# EAGLE design Focus_shield (EAGLE 9.6.2)
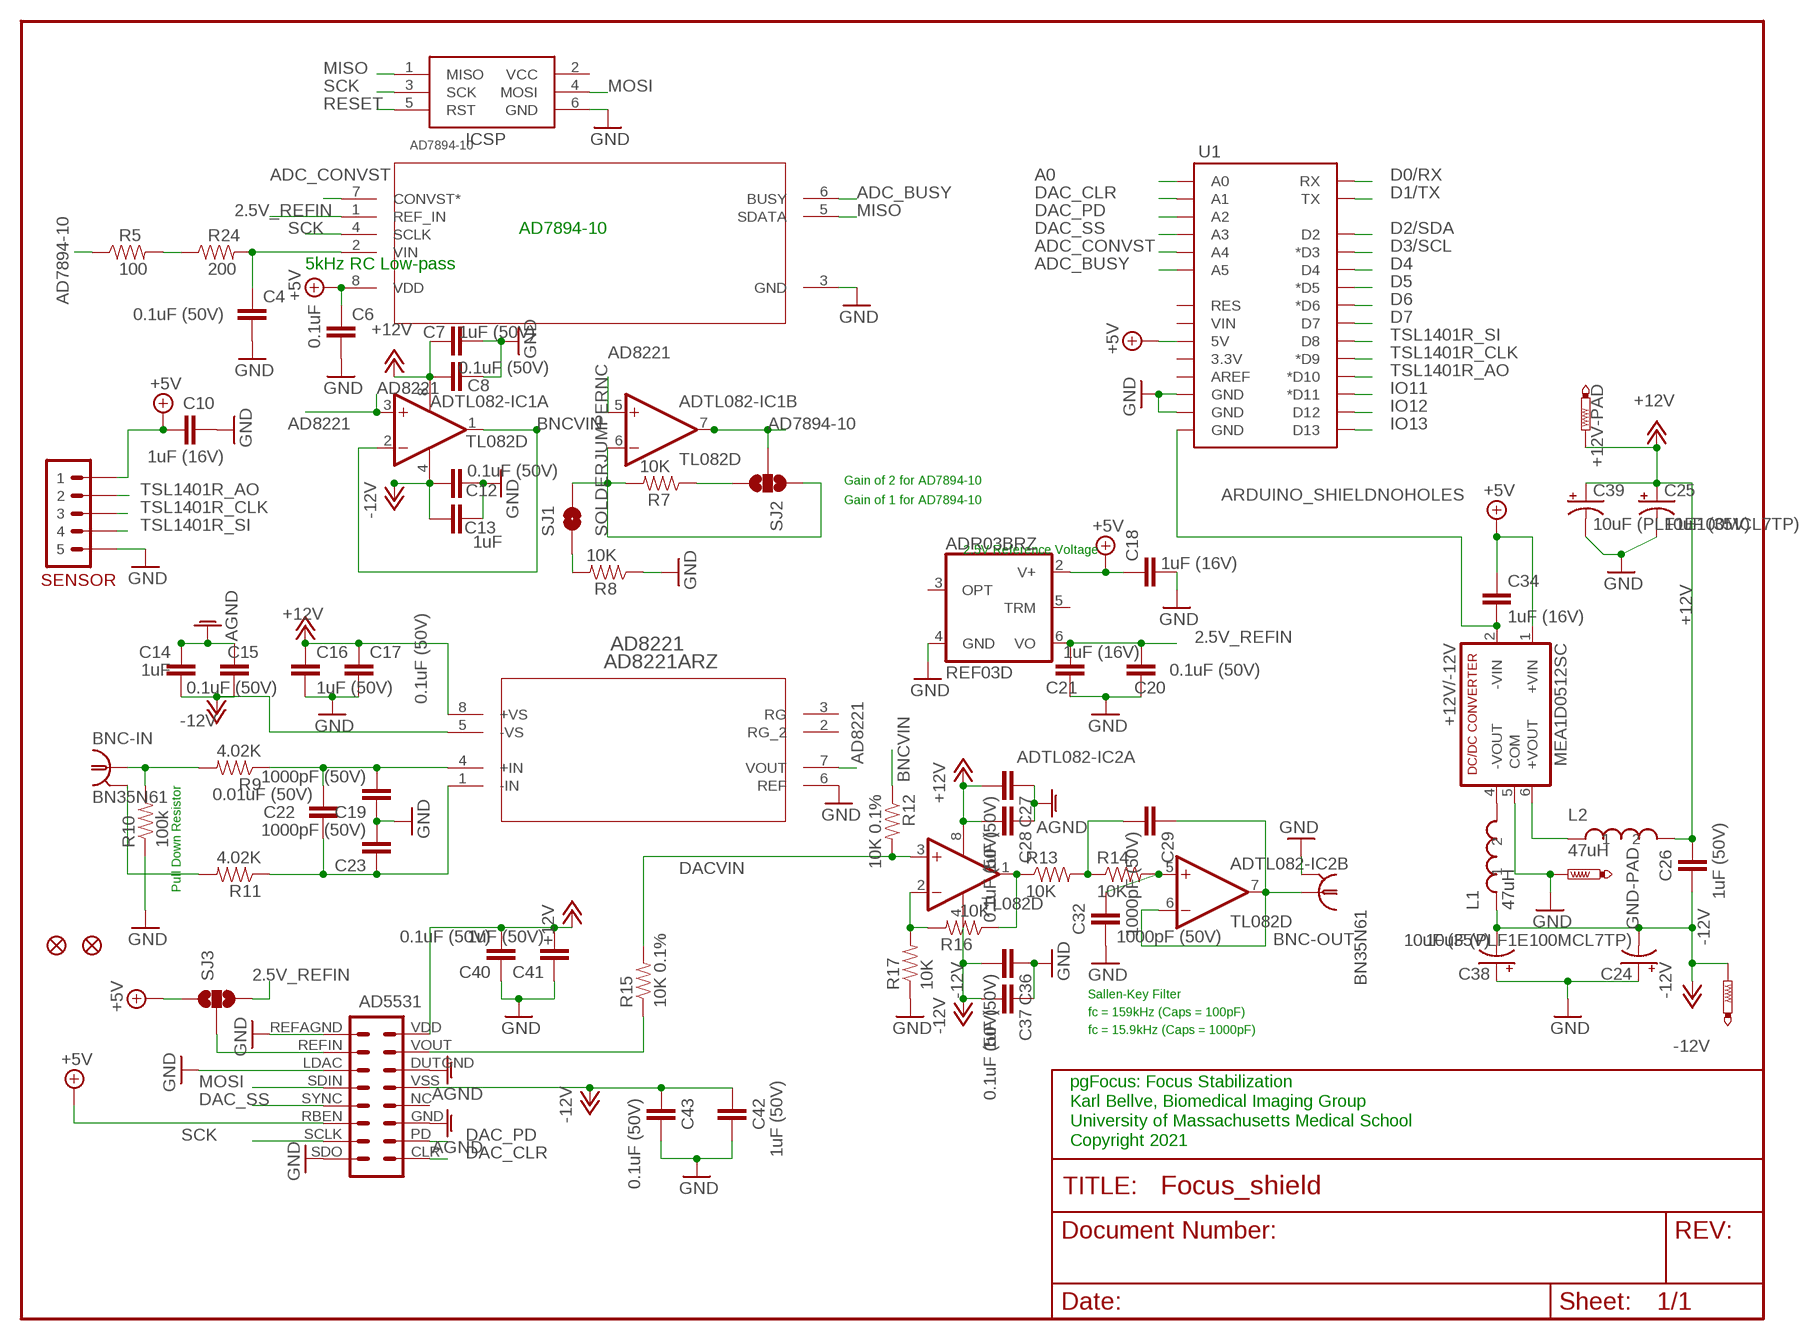
[diagram p0: schematic, sheet 1]

## Parts
+12V-PAD  PTR1TP20R  [TP20R]
-12V  PTR1TP20R  [TP20R]
AD5331  AD5331  [AD5531]
AD7894-10  AD7894ARZ-10  AD7894ARZ-3  [R_8]
AD8221  AD8221ARZ  [R_8]
ADR03BRZ  REF03D  [SO08]
ADTL082-IC1  TL082D  [SO08]
ADTL082-IC2  TL082D  [SO08]
BNC-IN  BN35N61  [B35N61]
BNC-OUT  BN35N61  [B35N61]
C4  0.1uF (50V)  CAP0603-CAP  [0603-CAP]
C6  0.1uF  CAP0603-CAP  [0603-CAP]
C7  1uF (50V)  CAP0603-CAP  [0603-CAP]
C8  0.1uF (50V)  CAP0603-CAP  [0603-CAP]
C10  1uF (16V)  CAP0603-CAP  [0603-CAP]
C12  0.1uF (50V)  CAP0603-CAP  [0603-CAP]
C13  1uF  CAP0603-CAP  [0603-CAP]
C14  1uF  CAP0603-CAP  [0603-CAP]
C15  0.1uF (50V)  CAP0603-CAP  [0603-CAP]
C16  1uF (50V)  CAP0603-CAP  [0603-CAP]
C17  0.1uF (50V)  CAP0603-CAP  [0603-CAP]
C18  1uF (16V)  CAP0603-CAP  [0603-CAP]
C19  1000pF (50V)  CAP0603-CAP  [0603-CAP]
C20  0.1uF (50V)  CAP0603-CAP  [0603-CAP]
C21  1uF (16V)  CAP0603-CAP  [0603-CAP]
C22  0.01uF (50V)  CAP0603-CAP  [0603-CAP]
C23  1000pF (50V)  CAP0603-CAP  [0603-CAP]
C24  10uF (PLF1E100MCL7TP)  CAP_POLPTH1  [CPOL-RADIAL-100UF-25V]
C25  10uF (35V)  CAP_POL1206-KIT  [EIA3216-KIT]
C26  1uF (50V)  CAP0603-CAP  [0603-CAP]
C27  1uF (50V)  CAP0603-CAP  [0603-CAP]
C28  0.1uF (50V)  CAP0603-CAP  [0603-CAP]
C29  1000pF (50V)  CAP0603-CAP  [0603-CAP]
C32  1000pF (50V)  CAP0603-CAP  [0603-CAP]
C34  1uF (16V)  CAP0603-CAP  [0603-CAP]
C36  1uF (50V)  CAP0603-CAP  [0603-CAP]
C37  0.1uF (50V)  CAP0603-CAP  [0603-CAP]
C38  10uF (35V)  CAP_POL1206-KIT  [EIA3216-KIT]
C39  10uF (PLF1E100MCL7TP)  CAP_POLPTH1  [CPOL-RADIAL-100UF-25V]
C40  0.1uF (50V)  CAP0603-CAP  [0603-CAP]
C41  1uF (50V)  CAP0603-CAP  [0603-CAP]
C42  1uF (50V)  CAP0603-CAP  [0603-CAP]
C43  0.1uF (50V)  CAP0603-CAP  [0603-CAP]
GND-PAD  PTR1TP20R  [TP20R]
ICSP  AVRISP-6  [AVRISP]
JP1  FIDUCIAL1.5X3  [FIDUCIAL-1.5X3]
JP2  FIDUCIAL1.5X3  [FIDUCIAL-1.5X3]
L1  47uH  11R473C  [11R473C]
L2  47uH  11R473C  [11R473C]
MEA1D0512SC  +12V/-12V  NMA  [NMA]
R5  100  RESISTOR0603-RES  [0603-RES]
R7  10K  RESISTOR0603-RES  [0603-RES]
R8  10K  RESISTOR0603-RES  [0603-RES]
R9  4.02K  RESISTOR0603-RES  [0603-RES]
R10  100k  RESISTOR0603-RES  [0603-RES]
R11  4.02K  RESISTOR0603-RES  [0603-RES]
R12  10K 0.1%  RESISTOR0603-RES  [0603-RES]
R13  10K  RESISTOR0603-RES  [0603-RES]
R14  10K  RESISTOR0603-RES  [0603-RES]
R15  10K 0.1%  RESISTOR0603-RES  [0603-RES]
R16  10K  RESISTOR0603-RES  [0603-RES]
R17  10K  RESISTOR0603-RES  [0603-RES]
R24  200  RESISTOR0603-RES  [0603-RES]
SENSOR  M05  [M05JST-PTH]
SJ1  SOLDERJUMPERNC  [SJ_2S]
SJ2  SOLDERJUMPER_2WAYPASTE2&3  [SJ_3_PASTE2&3]
SJ3  SOLDERJUMPER_2WAYPASTE2&3  [SJ_3_PASTE2&3]
U1  ARDUINO_SHIELDNOHOLES  [DUEMILANOVE_SHIELD_NOHOLES]

## Nets
2.5V_REFIN: AD7894-10.1(REF_IN) ADR03BRZ.6(VO) C20.1 C21.1 SJ3.3
+5V: AD5331.RBEN AD7894-10.8(VDD) ADR03BRZ.2(V+) C6.1 C10.1 C18.1 C34.1 MEA1D0512SC.1(+VIN) SENSOR.P$1 SJ3.1 U1.5V
+12V: +12V-PAD.TP AD5331.VDD AD8221.8(+VS) ADTL082-IC1.8(P:V+) ADTL082-IC2.8(P:V+) C7.2 C8.2 C16.1 C17.1 C25.A(+) C26.1 C27.2 C28.2 C39.1(+) C40.2 C41.2 L2.P$2
-12V: -12V.TP AD5331.VSS AD8221.5(-VS) ADTL082-IC1.4(P:V-) ADTL082-IC2.4(P:V-) C12.2 C13.2 C14.1 C15.1 C24.2(-) C26.2 C36.2 C37.2 C38.C(-) C42.2 C43.2 L1.P$1
A0: U1.A0
AD7894-10: ADTL082-IC1.7(B:OUT) R5.1 SJ2.2
AD8221: AD8221.7(VOUT) ADTL082-IC1.3(A:+IN) ADTL082-IC1.5(B:+IN)
ADC_BUSY: AD7894-10.6(BUSY) U1.A5
ADC_CONVST: AD7894-10.7(CONVST*) U1.A4
BNCVIN: ADTL082-IC1.1(A:OUT) ADTL082-IC1.2(A:-IN) R12.1
D0/RX: U1.RX
D1/TX: U1.TX
D2/SDA: U1.D2
D3/SCL: U1.D3(*D3)
D4: U1.D4
D5: U1.D5(*D5)
D6: U1.D6(*D6)
D7: U1.D7
DAC_CLR: AD5331.CLR U1.A1
DAC_PD: AD5331.PD U1.A2
DAC_SS: AD5331.SYNC U1.A3
DACVIN: ADTL082-IC2.3(A:+IN) R12.2 R15.2
DCGND: C34.2 MEA1D0512SC.2(-VIN) U1.GND@0(GND)
GND: AD5331.DUTGND AD5331.GND AD5331.LDAC AD5331.REFAGND AD5331.SDO AD7894-10.3(GND) AD8221.6(REF) ADR03BRZ.4(GND) BNC-OUT.2 BNC-OUT.3 BNC-OUT.4 BNC-OUT.5 C4.2 C6.2 C7.1 C8.1 C10.2 C12.1 C13.1 C14.2 C15.2 C16.2 C17.2 C18.2 C19.1 C20.2 C21.2 C23.2 C24.1(+) C25.C(-) C27.1 C28.1 C32.2 C36.1 C37.1 C38.A(+) C39.2(-) C40.1 C41.1 C42.1 C43.1 GND-PAD.TP ICSP.6(GND) MEA1D0512SC.5(COM) R8.1 R10.1 R17.1 SENSOR.P$5 U1.GND@1(GND) U1.GND@2(GND) ; supply symbol labelled AGND
IO11: U1.D11(*D11)
IO12: U1.D12
IO13: U1.D13
MISO: AD7894-10.5(SDATA) ICSP.1(MISO)
MOSI: AD5331.SDIN ICSP.4(MOSI)
N$1: ADTL082-IC2.2(A:-IN) R16.2 R17.2
N$2: ADTL082-IC2.5(B:+IN) C32.1 R14.2
N$3: AD7894-10.2(VIN) C4.1 R24.2
N$4: AD8221.1(-IN) C22.1 C23.1 R11.1
N$5: R5.2 R24.1
N$6: L2.P$1 MEA1D0512SC.6(+VOUT)
N$7: ADTL082-IC2.1(A:OUT) R13.1 R16.1
N$8: L1.P$2 MEA1D0512SC.4(-VOUT)
N$9: R7.1 SJ2.3
N$10: R8.2 SJ1.1
N$13: BNC-IN.2 BNC-IN.3 BNC-IN.4 BNC-IN.5 R11.2
N$14: AD8221.4(+IN) C19.2 C22.2 R9.1
N$16: C29.2 R13.2 R14.1
N$17: BNC-IN.1 R9.2 R10.2
N$18: ADTL082-IC1.6(B:-IN) R7.2 SJ1.2 SJ2.1
N$23: ADTL082-IC2.6(B:-IN) ADTL082-IC2.7(B:OUT) BNC-OUT.1 C29.1
REFIN: AD5331.REFIN SJ3.2
RESET: ICSP.5(RST)
SCK: AD5331.SCLK AD7894-10.4(SCLK) ICSP.3(SCK)
TSL1401R_AO: SENSOR.P$2 U1.D10(*D10)
TSL1401R_CLK: SENSOR.P$3 U1.D9(*D9)
TSL1401R_SI: SENSOR.P$4 U1.D8
VOUT: AD5331.VOUT R15.1
Unconnected: AD5331.NC AD8221.2(RG_2) AD8221.3(RG) ADR03BRZ.3(OPT) ADR03BRZ.5(TRM) U1.3.3V U1.AREF U1.RES U1.VIN

## Notes on the sheet
- AD7894-10
- 5kHz RC Low-pass
- Gain of 2 for AD7894-10
- Gain of 1 for AD7894-10
- 2.5V Reference Voltage
- Pull Down Resistor
- Sallen-Key Filter
- fc = 159kHz (Caps = 100pF)
- fc = 15.9kHz (Caps = 1000pF)
- pgFocus: Focus Stabilization
- Karl Bellve, Biomedical Imaging Group
- University of Massachusetts Medical School
- Copyright 2021

## Power pins joined to a net without a drawn wire
VCC: ICSP.2(VCC)

## Library data of the parts
+12V-PAD -12V GND-PAD = testpad:PTR1: TEST PIN
AD5331 = BIG:AD5331: The AD5530/AD5531 are single 12- and 14-bit (respectively) serial input, voltage output digital-to-analog converters (DAC).
AD7894-10 = BIG:AD7894ARZ-3; MANUFACTURER_PART_NUMBER: AD7894ARZ-3; VENDOR: Vendor
AD8221 = BIG:AD8221ARZ
ADR03BRZ = linear:REF03: VOLTAGE REFERENCE
ADTL082-IC1 ADTL082-IC2 = linear:TL082: OP AMP
BNC-IN BNC-OUT = con-coax:BN35N61: BNC CONNECTOR M/A COM www.macom.com distributor Farnell 149-452; OC_FARNELL: unknown; OC_NEWARK: unknown
C4 C6-C8 C10 C12-C23 C26-C29 C32 C34 C36 C37 C40-C43 = SparkFun:CAP: Capacitor Standard 0603 ceramic capacitor, and 0.1" leaded capacitor.
C24 C39 = SparkFun-Passives:CAP_POL: Capacitor Polarized These are standard SMD and PTH capacitors. Normally 10uF, 47uF, and 100uF in electrolytic and tantalum varieties. Always verify the external diameter of the through hole cap, it varies with capacity, voltage, and manufacturer. The EIA devices should be standard.
C25 C38 = SparkFun:CAP_POL: Capacitor Polarized These are standard SMD and PTH capacitors. Normally 10uF, 47uF, and 100uF in electrolytic and tantalum varieties. Always verify the external diameter of the through hole cap, it varies with capacity, voltage, and manufacturer. The EIA devices should be standard.
ICSP = adafruit:AVRISP: AVR ISP HEADER Standard 6 pin header for AVR programming
JP1 JP2 = SparkFun:FIDUCIAL: Fiducial Alignment Points Various fiducial points for machine vision alignment.
L1 L2 = BIG:11R473C: 47 uF inductor
MEA1D0512SC = dc-dc-converter:NMA: DC-DC CONVERTER; MF: C & D TECHNOLOGIES, INC; MPN: NMA0515SC; OC_FARNELL: 1021434; OC_NEWARK: 61K3064
R5 R7-R17 R24 = SparkFun:RESISTOR: Resistor Basic schematic elements and footprints for 0603, 1206, and PTH resistors.
SENSOR = BIG:M05
SJ1 = SparkFun-Passives:SOLDERJUMPER: Solder Jumper Standard SMD solder jumper. Used to automate production. Two varients : Normally Open and Normally Closed are the same, but have different paste layers. NC will have a large amount of paste and should jumper during reflow.
SJ2 SJ3 = SparkFun-Passives:SOLDERJUMPER_2WAY: Solder Jumper 2 way solder jumper
U1 = SparkFun-Boards:ARDUINO_SHIELD: Arduino shield footprint

## Board
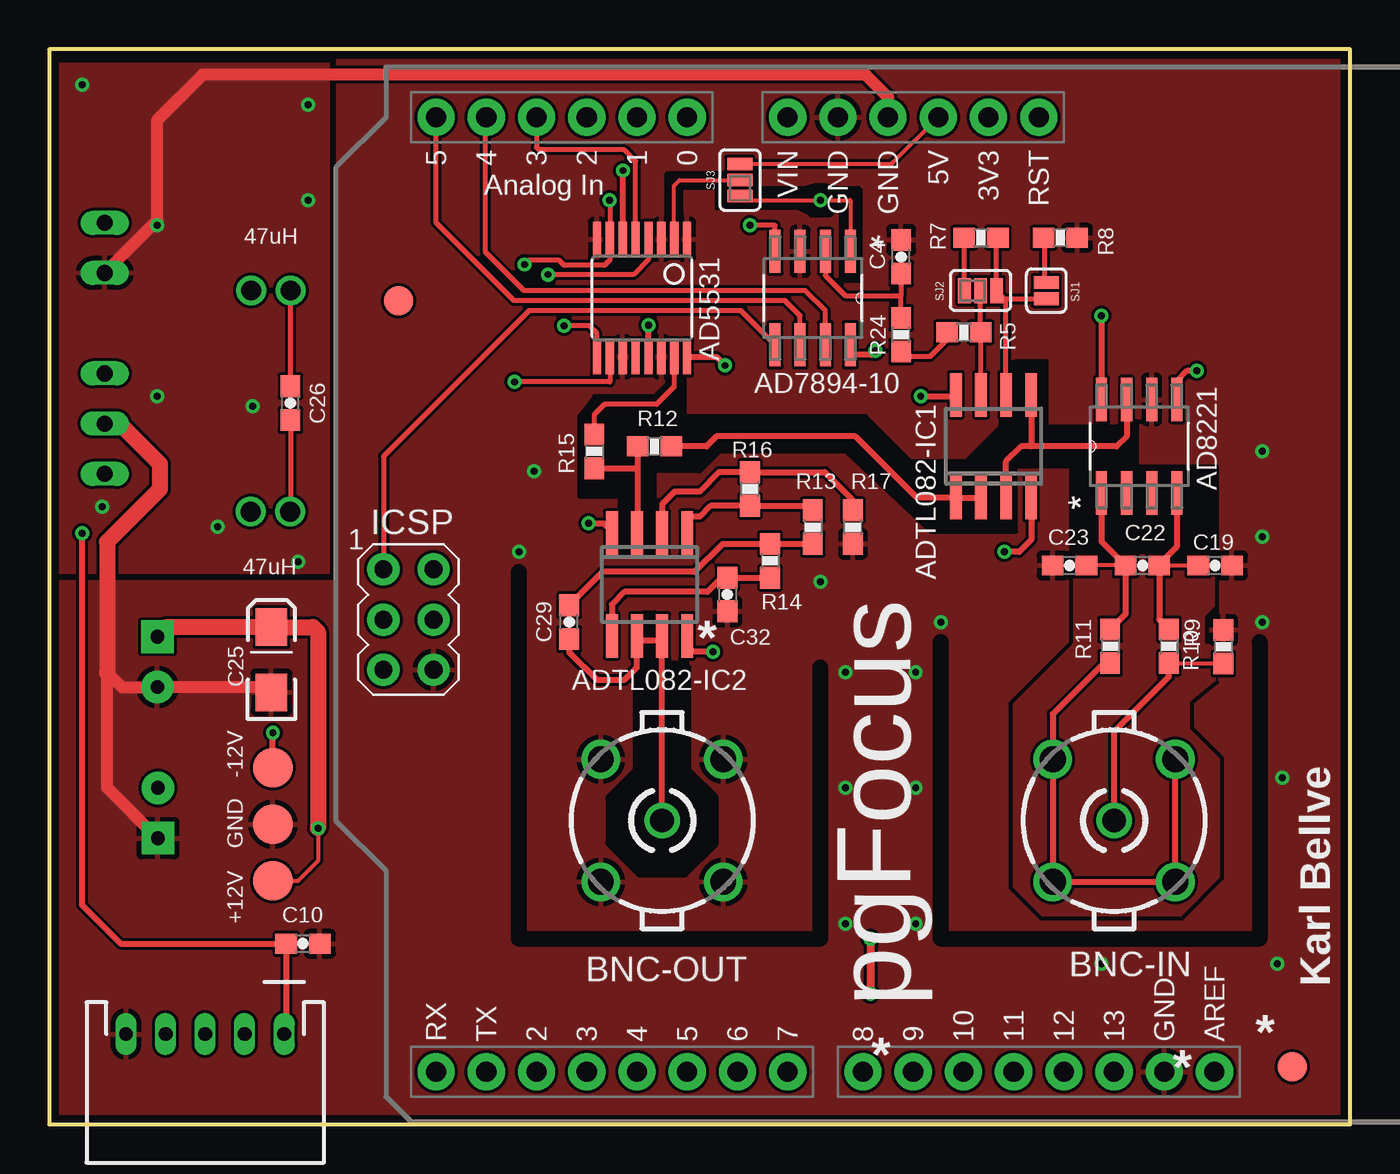
[diagram p1: board, top side]
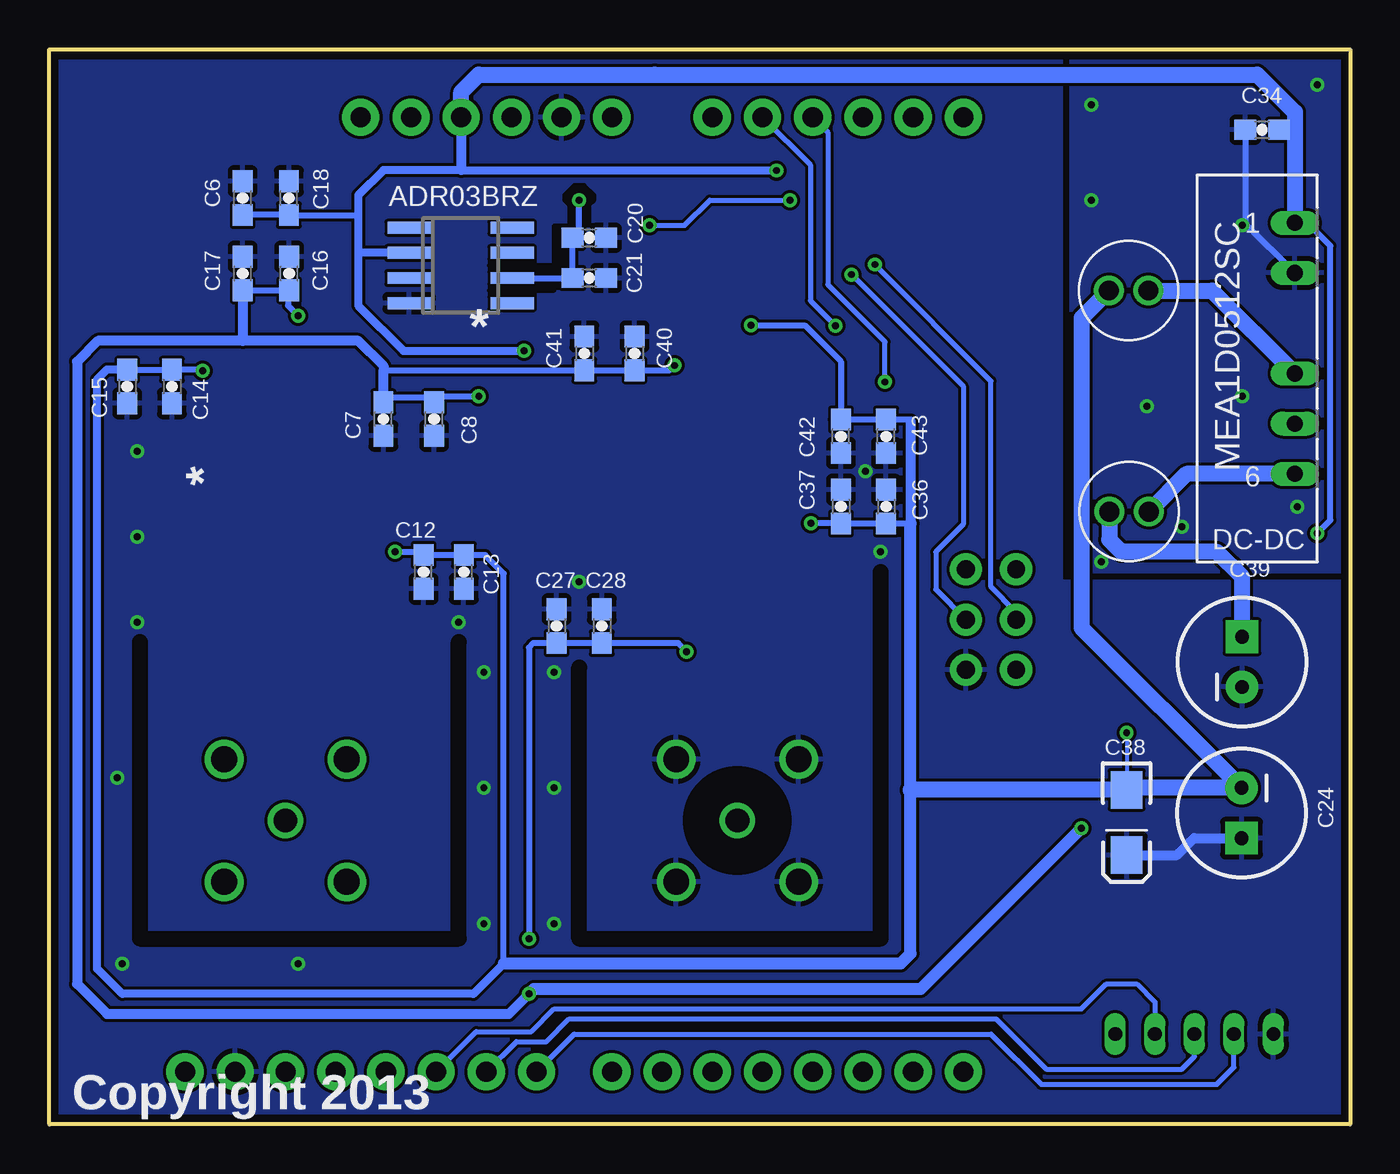
[diagram p2: board, bottom side, seen from below]

Size 65.79 x 54.36 mm. Coordinates in mm from the lower left corner, seen from the top.
Outline: 0,0 65.79,0 65.79,54.36 0,54.36 0,0
Copper layers (1*16): Top 0.0356mm / dielectric 1.5011mm / Bottom 0.0356mm
Design rules "LaenPCBOrder *": minimum track width 6mil, minimum drill 13mil, track to track 6mil, track to pad 6mil, pad to pad 6mil, via to via 6mil, smd to smd 6mil, copper to edge 15mil, drill to drill 6mil, minimum pad ring 7mil, minimum via ring 7mil, stop-mask expansion 4mil, vias tented up to drill 0mil, thermal gap 10mil
tRestrict: 78 lines
bRestrict: area 28.4,12.8 to 33.5,17.9; 19 lines

### Footprints (pad centres in the part's own frame; a part is rotated, then mirrored left to right if it is on the bottom)
TP20R = smd 2 x 2: TP 0,0
AD5531 = smd 0.42 x 1.78: CLR 2.275,2.97; DUTGND -0.975,2.97; GND 0.975,2.97; LDAC -0.975,-2.97; NC 0.325,2.97; PD 1.625,2.97; RBEN 0.975,-2.97; REFAGND -2.275,-2.97; REFIN -1.625,-2.97; SCLK 1.625,-2.97; SDIN -0.325,-2.97; SDO 2.275,-2.97; SYNC 0.325,-2.97; VDD -2.275,2.97; VOUT -1.625,2.97; VSS -0.325,2.97
R_8 = smd 2.184 x 0.559: 1 -2.362,1.905; 2 -2.362,0.635; 3 -2.362,-0.635; 4 -2.362,-1.905; 5 2.362,-1.905; 6 2.362,-0.635; 7 2.362,0.635; 8 2.362,1.905
SO08 = smd 0.6 x 2.2: 1 -1.905,-2.6; 2 -0.635,-2.6; 3 0.635,-2.6; 4 1.905,-2.6; 5 1.905,2.6; 6 0.635,2.6; 7 -0.635,2.6; 8 -1.905,2.6
B35N61 = drill 1.2: 1 0,0 | drill 1.3: 2 3.099,3.099; 3 -3.099,3.099; 4 -3.099,-3.099; 5 3.099,-3.099
0603-CAP = smd 1.1 x 1: 1 -0.85,0; 2 0.85,0
CPOL-RADIAL-100UF-25V = drill 0.7 pad 1.651 square: 1 1.27,0 | drill 0.7 pad 1.651: 2 -1.27,0
EIA3216-KIT = smd 1.9 x 1.6: A 1.65,0; C -1.65,0
AVRISP = drill 0.9 pad 1.626: 1 -1.27,2.54; 2 1.27,2.54; 3 -1.27,0; 4 1.27,0; 5 -1.27,-2.54; 6 1.27,-2.54
FIDUCIAL-1.5X3 = smd 1.5 x 1.5: 1 0,0
11R473C = drill 1: P$1 -1,0; P$2 1,0
NMA = drill 0.813 long: 1 0,6.35; 2 0,3.81; 4 0,-1.27; 5 0,-3.81; 6 0,-6.35
0603-RES = smd 1.1 x 1: 1 -0.85,0; 2 0.85,0
M05JST-PTH = drill 0.7 long: P$1 0,-4; P$2 0,-2; P$3 0,0; P$4 0,2; P$5 0,4
SJ_2S = smd 0.635 x 1.27: 1 -0.412,0; 2 0.412,0
SJ_3_PASTE2&3 = smd 0.635 x 1.27: 1 -0.813,0; 2 0,0; 3 0.813,0
DUEMILANOVE_SHIELD_NOHOLES = drill 1.016 pad 1.88: 3.3V 50.8,26.67; 5V 50.8,29.21; A0 50.8,41.91; A1 50.8,44.45; A2 50.8,46.99; A3 50.8,49.53; A4 50.8,52.07; A5 50.8,54.61; AREF 2.54,15.24; D2 2.54,49.53; D3 2.54,46.99; D4 2.54,44.45; D5 2.54,41.91; D6 2.54,39.37; D7 2.54,36.83; D8 2.54,33.02; D9 2.54,30.48; D10 2.54,27.94; D11 2.54,25.4; D12 2.54,22.86; D13 2.54,20.32; GND@0 50.8,31.75; GND@1 50.8,34.29; GND@2 2.54,17.78; RES 50.8,24.13; RX 2.54,54.61; TX 2.54,52.07; VIN 50.8,36.83

### Placement (x,y rotation side)
+12V-PAD  11.3,12.32 270 top
-12V  11.3,18.03 270 top
AD5331  29.97,41.78 180 top
AD7894-10  38.61,41.78 270 top
AD8221  55.12,34.29 90 top
ADR03BRZ  44.98,43.43 270 bottom
ADTL082-IC1  47.75,34.29 0 top
ADTL082-IC2  30.35,27.3 180 top
BNC-IN  53.85,15.37 270 top
BNC-OUT  30.99,15.37 270 top
C4  43.08,43.87 90 top
C6  56.01,46.84 90 bottom
C7  48.89,35.67 90 bottom
C8  46.33,35.67 90 bottom
C10  12.83,9.14 0 top
C12  46.86,27.94 90 bottom
C13  44.83,27.94 90 bottom
C14  59.59,37.31 270 bottom
C15  61.85,37.31 270 bottom
C16  53.66,43.03 90 bottom
C17  56.01,43.03 90 bottom
C18  53.67,46.84 90 bottom
C19  58.96,28.26 180 top
C20  38.48,44.83 0 bottom
C21  38.48,42.8 0 bottom
C22  55.28,28.26 0 top
C23  51.59,28.26 180 top
C24  5.49,15.75 270 bottom
C25  11.23,23.49 90 top
C26  12.19,36.47 90 top
C27  40.13,25.2 270 bottom
C28  37.85,25.2 270 bottom
C29  26.29,25.4 90 top
C32  34.29,26.8 270 top
C34  4.45,50.29 180 bottom
C36  23.47,31.24 270 bottom
C37  25.76,31.24 270 bottom
C38  11.3,15.27 270 bottom
C39  5.46,23.39 90 bottom
C40  36.19,38.99 270 bottom
C41  38.73,38.99 270 bottom
C42  25.76,34.8 90 bottom
C43  23.47,34.8 90 bottom
GND-PAD  11.3,15.18 270 top
ICSP  18.16,25.53 0 top
JP1  62.86,2.92 0 top
JP2  17.65,41.66 0 top
L1  11.2,42.16 0 bottom
L2  11.18,30.99 180 bottom
MEA1D0512SC  2.79,39.24 0 bottom
R5  46.25,40.06 180 top
R7  47.12,44.83 0 top
R8  51.13,44.83 180 top
R9  56.62,24.18 270 top
R10  59.37,24.16 270 top
R11  53.65,24.18 270 top
R12  30.61,34.29 180 top
R13  38.61,30.21 270 top
R14  36.45,28.5 270 top
R15  27.56,34.04 270 top
R16  35.43,32.13 90 top
R17  40.64,30.21 90 top
R24  43.08,39.93 90 top
SENSOR  7.87,4.57 90 top
SJ1  50.42,42.16 270 top
SJ2  47.09,42.16 180 top
SJ3  34.92,47.75 270 top
U1  74.17,0.13 90 top

### Tracks (layer width: path | path; a pad name or v marks a point on that pad's centre or on a via)
2.5V_REFIN  (via drill 0.35)
  Top 0.203: AD7894-10.1 40.51,46.74 v38.99,46.74 35.13,46.74 SJ3.3
  Bottom 0.305: ADR03BRZ.6 C21.1 C20.1 38.99,45.17 v38.99,46.74
+5V  (via drill 0.35)
  Top 0.203: U1.5V 42.67,48.64 42.6,48.56 SJ3.1
  Top 0.254: 11.98,4.67 SENSOR.P$1
  Top 0.305: v1.65,29.9 1.65,11.09 3.59,9.14 C10.1 11.98,4.67 | v29.01,48.23 v29,48.23 AD5331.RBEN | AD7894-10.8 40.51,38.91 41.58,38.91 v41.78,39.12
  Bottom 0.305: C34.1 2.79,50.29 | MEA1D0512SC.1 2.16,45.59 0.99,44.42 0.99,30.56 v1.65,29.9 | 35.09,53 35.18,53.09 | 50.16,45.97 53.66,45.97 C18.1 C6.1 | v29.01,48.23 29.03,48.26 | 50.04,44.07 50.16,44.2
  Bottom 0.406: v41.78,39.12 47.88,39.12 50.16,41.4 50.16,44.2 50.16,45.97 50.16,46.99 48.89,48.26 44.96,48.26 29.03,48.26 | ADR03BRZ.2 50.04,44.07
  Bottom 0.508: U1.5V 44.96,48.26
  Bottom 0.813: U1.5V 44.96,52.2 44.07,53.09 35.18,53.09 4.7,53.09 2.79,51.18 2.79,50.29 MEA1D0512SC.1
+12V  (via drill 0.35)
  Top 0.203: v13.59,14.99 13.59,13.33 12.57,12.32 +12V-PAD.TP
  Top 0.254: C26.1 12.19,31 L2.P$2
  Top 0.305: 32.41,24.86 ADTL082-IC2.8 32.26,24.2 32.54,23.91 v33.56,23.91 | v53.21,40.89 AD8221.8 | AD8221.8 | v44.07,36.83 45.79,36.83 ADTL082-IC1.8 | AD5331.VDD 33.73,38.81 v34.16,38.38
  Top 0.406: v41.53,9.4 v41.53,6.6
  Top 0.508: 5.94,25.14 C39.1
  Top 0.813: 5.94,25.14 C25.A 13.34,25.14 13.59,24.89 v13.59,14.99
  Bottom 0.203: C41.2 38.73,38.1
  Bottom 0.305: v41.53,9.4 41.53,24.13 41.31,24.35 C27.2 C28.2 33.99,24.35 v33.56,23.91 | v44.07,36.83 46.02,36.83 46.08,36.76 | C8.2 46.08,36.76 | C7.2 48.65,36.76 46.08,36.76 | C17.1 C16.1 53.72,42.11 53.72,41.4 v53.21,40.89 | 38.73,38.1 48.89,38.1 | C41.2 C40.2 34.4,38.14 v34.16,38.38
  Bottom 0.508: v41.53,6.6 42.54,5.59 62.86,5.59 64.39,7.11 64.39,38.57 63.33,39.62 56.01,39.62 | C7.2 48.89,38.1 48.89,38.35 50.16,39.62 56.01,39.62 | C17.1 56.01,39.62
  Bottom 0.61: v41.53,6.6 41.27,6.86 21.72,6.86 v13.59,14.99
  Bottom 0.813: L2.P$2 12.18,29.57 11.56,28.96 6.73,28.96 5.46,27.69 C39.1
-12V  (via drill 0.35)
  Top 0.254: C26.2 L1.P$1
  Top 0.305: 28.36,30.65 28.45,30.73 ADTL082-IC2.4 28.45,29.97 28.03,30.39 v27.27,30.39 | 48.4,29.06 v48.3,28.96 49.06,28.96 49.66,29.55 ADTL082-IC1.4 | v58.04,38.1 57.53,38.1 57.02,37.59 AD8221.5 | AD5331.VSS v30.3,40.4 v30.3,40.41 | -12V.TP v11.3,19.81
  Top 0.508: C24.2 5.51,17.02 5.51,16.99
  Bottom 0.203: v11.3,19.81 C38.C
  Bottom 0.305: C42.2 26.11,35.65 | v27.27,30.39 C37.2 C36.2 | v48.3,28.96 46.86,28.96 C12.2 C13.2 43.75,28.79 42.81,27.85 42.81,8.13 | C15.1 C14.1 58.1,38.16 v58.04,38.1 | C42.2 C43.2 22.34,35.65 22.23,35.53 | C36.2 | C36.2 22.23,30.39 | v30.3,40.41 27.58,40.41 25.76,38.58 C42.2
  Bottom 0.406: C15.1 62.88,38.16 63.37,37.67 63.37,7.87 62.1,6.6 44.33,6.6 42.81,8.13
  Bottom 0.508: C38.C 11.23,16.99 | C38.C 11.56,16.91 11.45,17.02 | C38.C | 22.23,35.53 22.23,30.39
  Bottom 0.61: 42.81,8.13 22.73,8.13 22.23,8.64 22.23,16.91 22.23,30.39
  Bottom 0.813: L1.P$1 13.59,40.78 13.59,25.12 C24.2 11.45,17.02 | C38.C 22.23,16.91
AD7894-10
  Top 0.254: ADTL082-IC1.7 47.12,40.04 R5.1 47.09,40.07 SJ2.2
AD8221
  Top 0.305: 54.48,36.2 AD8221.7 54.48,34.8 53.97,34.29 49.66,34.29 | ADTL082-IC1.5 49.66,34.29 | 49.66,34.29 49.15,34.29 48.39,33.53 ADTL082-IC1.3
ADC_BUSY
  Top 0.254: AD7894-10.6 37.97,40.89 37.21,41.66 23.5,41.66 19.56,45.59 U1.A5
ADC_CONVST
  Top 0.254: AD7894-10.7 39.24,41.15 38.23,42.16 24,42.16 22.07,44.09 22.07,50.9 U1.A4
BNCVIN
  Top 0.305: R12.1 33.23,34.29 33.74,34.8 40.77,34.8 43.88,31.69 ADTL082-IC1.1 ADTL082-IC1.2
DAC_CLR  (via drill 0.35)
  Top 0.254: AD5331.CLR 27.7,39.99 27.3,40.39 v26.04,40.39
  Bottom 0.254: v26.04,40.39 27.3,41.66 27.3,48.51 U1.A1
DAC_PD  (via drill 0.35)
  Top 0.254: AD5331.PD 28.35,37.54 v23.52,37.54
  Bottom 0.254: U1.A2 26.42,50.16 26.42,42.47 23.52,39.57 v23.52,37.54
DAC_SS
  Top 0.254: U1.A3 24.64,49.4 24.77,49.28 29.08,49.28 29.65,48.71 AD5331.SYNC
DACVIN
  Top 0.305: 27.81,32.93 R15.2 29.67,33.19 29.76,33.27 | 29.73,34.26 R12.2 29.76,33.27 | 29.76,33.27 29.76,29.94 ADTL082-IC2.3
DCGND  (via drill 0.35)
  Top 0.61: U1.GND@0 42.42,51.94 41.27,53.09 7.75,53.09 5.46,50.8 5.46,45.72 MEA1D0512SC.2
  Bottom 0.305: C34.2 5.29,45.55 MEA1D0512SC.2
  other vias: 5.46,36.83 1.65,52.58 13.08,51.56 2.67,31.24 5.46,45.47 12.57,28.45 8.51,30.23 13.08,46.74 10.29,36.32
  pour Top: 14.1,53.59 0.38,53.59 0.38,27.94 14.1,27.94
  pour Bottom: 14.1,53.85 0.38,53.85 0.38,27.94 14.1,27.94
GND  (via drill 0.35)
  Top 0.61: MEA1D0512SC.5 3.56,35.43 | C25.C 10.95,22.12 C39.2 5.44,22.1 3.68,22.1 2.92,22.86 2.92,17.04 C24.1
  Top 0.813: 3.56,35.43 5.59,33.4 5.59,32.13 2.92,29.46 2.92,22.86
  Bottom 0.508: C38.A 8.76,13.61 7.9,14.48 C24.1
  other vias: 61.34,34.04 61.34,29.72 61.34,25.4 43.81,22.86 40.26,22.86 23.75,28.96 38.99,27.43 45.08,25.4 24.51,33.02 43.81,10.16 62.1,8.13 53.21,8.13 62.36,17.53 43.81,17.02 40.26,17.02 40.26,10.16
  pour Top: 14.61,53.85 65.41,53.85 65.41,0.51 0.38,0.51 0.38,27.43 14.61,27.43
  pour Bottom: 0.38,0.51 0.38,27.43 14.61,27.43 14.61,53.85 65.41,53.85 65.41,0.51
MISO
  Top 0.254: AD7894-10.5 34.98,41.15 24.26,41.15 16.89,33.78 ICSP.1
MOSI  (via drill 0.35)
  Top 0.254: AD5331.SDIN 30.3,43.74 29.54,42.98 v25.22,42.98
  Bottom 0.254: ICSP.4 20.96,27.05 20.96,28.96 19.56,30.35 19.56,37.34 25.2,42.98 v25.22,42.98
N$1
  Top 0.305: ADTL082-IC2.2 30.99,31.37 31.62,32 32.89,32 33.87,32.98 R16.2 39.21,32.98 39.25,32.96 40.64,31.57 R17.2
N$2
  Top 0.305: ADTL082-IC2.5 28.45,26.29 29.08,26.92 33.27,26.92 34,27.65 C32.1 R14.2
N$3
  Top 0.254: C4.1 43.08,41.91 | AD7894-10.2 39.24,42.93 40.26,41.91 43.08,41.91 | R24.2 43.08,41.91
N$4
  Top 0.203: C22.1 C23.1 | AD8221.1
  Top 0.305: AD8221.1 53.21,31.81 | 53.21,31.67 AD8221.1 | R11.1 54.43,25.81 C22.1 53.21,29.48 AD8221.1
N$5
  Top 0.254: R24.1 43.33,38.82 44.54,38.82 45.4,39.69 R5.2
N$6
  Bottom 0.813: MEA1D0512SC.6 8.27,32.89 L2.P$1
N$7
  Top 0.305: R16.1 33.44,31.28 32.89,30.73 32.26,30.73 ADTL082-IC2.1 | R16.1 35.43,31.37 | R16.1 38.39,31.28 R13.1
  Top 0.406: 35.47,31.24 R16.1
N$8
  Bottom 0.813: MEA1D0512SC.4 6.98,42.16 L1.P$2
N$9
  Top 0.254: SJ2.3 46.27,42.18 R7.1
N$10
  Top 0.254: R8.2 50.31,44.8 50.31,42.68 SJ1.1
N$13
  Top 0.305: R11.2 53.33,23.33 50.75,20.75 BNC-IN.4 BNC-IN.5 BNC-IN.2 BNC-IN.3
  Bottom 0.305: BNC-IN.3 57.02,18.39
N$14
  Top 0.203: C19.2 C22.2 56.51,28.65 56.51,28.7
  Top 0.305: R9.1 56.51,25.14 | 56.51,25.14 56.48,25.18 | C22.2 56.13,25.52 56.51,25.14 | AD8221.4 57.02,29.21 56.51,28.7
N$16
  Top 0.305: R14.1 34.05,29.35 32.64,27.94 27.98,27.94 C29.2 | R14.1 36.45,29.64 | R14.1 R13.2
N$17
  Top 0.203: R9.2 59.35,23.33 R10.2
  Top 0.305: BNC-IN.1 53.85,19.87 56.62,22.64 R9.2
N$18
  Top 0.203: SJ2.1 47.9,41.94 47.88,41.91
  Top 0.254: SJ2.1 47.9,44.77 R7.2 | 48.06,42.58 47.9,42.42 SJ2.1 | SJ2.1 48.39,41.68 ADTL082-IC1.6 | 47.88,41.91 47.92,41.75 SJ1.2
N$23
  Top 0.203: ADTL082-IC2.7 30.99,24.64
  Top 0.305: BNC-OUT.1 30.99,24.64 ADTL082-IC2.7 30.73,24.45 29.97,24.45 ADTL082-IC2.6 29.72,23.11 29.08,22.48 27.69,22.48 26.29,23.88 C29.1
REFIN
  Top 0.203: SJ3.2 31.88,47.75 31.6,47.47 AD5331.REFIN
SCK  (via drill 0.35)
  Top 0.254: AD7894-10.4 36.7,45.47 v35.43,45.47 | v28.32,46.74 28.35,46.71 AD5331.SCLK 28.35,43.71 28.07,43.43 26.04,43.43 25.78,43.69 24.23,43.69 v24.03,43.48
  Bottom 0.254: ICSP.3 16.89,25.91 18.16,27.18 18.16,37.59 24.03,43.46 v24.03,43.48 | v35.43,45.47 33.66,45.47 32.38,46.74 v28.32,46.74
TSL1401R_AO
  Bottom 0.254: U1.D10 44.2,4.7 41.4,4.7 40.26,5.84 13.59,5.84 12.32,7.11 10.79,7.11 9.87,6.19 SENSOR.P$2
TSL1401R_CLK
  Bottom 0.254: U1.D9 42.16,4.19 40.64,4.19 39.5,5.33 17.91,5.33 15.37,2.79 8.51,2.79 7.87,3.43 SENSOR.P$3
TSL1401R_SI
  Bottom 0.254: U1.D8 39.24,4.57 18.16,4.57 15.62,2.03 6.73,2.03 5.87,2.89 SENSOR.P$4
VOUT
  Top 0.254: AD5331.VOUT 31.6,37.29 30.72,36.41 28.07,36.41 27.56,35.9 R15.1

### Text on the board
tPlace: Karl Bellve, | Biomedical Imaging Group | Program in Molecular Medicine | University of Massachusetts Medical School | 47uH | 47uH | pgFocus | * | Karl Bellve | * | * | *
bPlace: * | *
tNames: -12V | GND | +12V
bNames: Copyright 2013
bValues: Thank you
Document: -12V | +12V | GND